# EAGLE design RHC12-BTA (EAGLE 7.2.0)
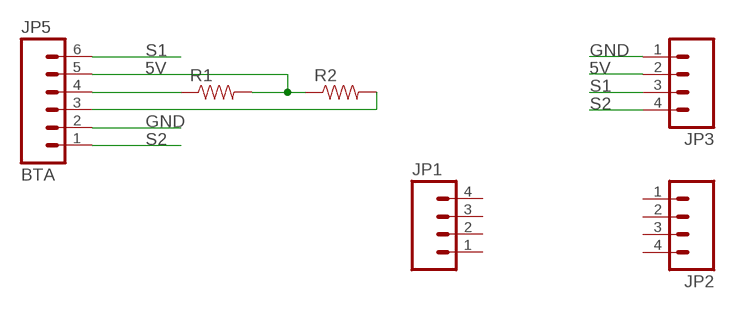
[diagram p0: schematic, sheet 1]

## Parts
JP1  M04SMD  [1X04-SMD]
JP2  M04SMD  [1X04-SMD]
JP3  M04SMD  [1X04-SMD]
JP5  BTA  M06VERNIER-ANALOG  [BTA]
R1  RESISTOR0603-RES  [0603-RES]
R2  RESISTOR0603-RES  [0603-RES]

## Nets
5V: JP3.2 JP5.5 R1.2 R2.1
GND: JP3.1 JP5.2
N$1: JP5.4 R1.1
N$3: JP5.3 R2.2
S1: JP3.3 JP5.6
S2: JP3.4 JP5.1
Unconnected: JP1.1 JP1.2 JP1.3 JP1.4 JP2.1 JP2.2 JP2.3 JP2.4

## Library data of the parts
JP1-JP3 = SparkFun-Connectors:M04: Header 4 Standard 4-pin 0.1" header. Use with straight break away headers (SKU : PRT-00116), right angle break away headers (PRT-00553), swiss pins (PRT-00743), machine pins (PRT-00117), and female headers (PRT-00115). Molex polarized connector foot print use with SKU : PRT-08231 with associated crimp pins and housings. 1MM SMD Version SKU: PRT-10208
JP5 = SparkFun-Connectors:M06: Header 6 Standard 6-pin 0.1" header. Use with straight break away headers (SKU : PRT-00116), right angle break away headers (PRT-00553), swiss pins (PRT-00743), machine pins (PRT-00117), and female headers (PRT-00115). Molex polarized connector foot print use with SKU : PRT-08094 with associated crimp pins and housings. NOTES ON THE VARIANTS LOCK and LOCK_LONGPADS... This footprint was designed to help hold the alignment of a through-hole component (i.e. 6-pin header) while soldering it into place. You may notice that each hole has been shifted either up or down by 0.005 of an inch from it's more standard position (which is a perfectly straight line). This slight alteration caused the pins (the squares in the middle) to touch the edges of the holes. Because they are alternating, it causes a "brace" to hold the component in place. 0.005 has proven to be the perfect amount of "off-center" position when using our standard breakaway headers. Although looks a little odd when you look at the bare footprint, once you have a header in there, the alteration is very hard to notice. Also,if you push a header all the way into place, it is covered up entirely on the bottom side. This idea of altering the position of holes to aid alignment will be further integrated into the Sparkfun Library for other footprints. It can help hold any component with 3 or more connection pins.
R1 R2 = SparkFun-Passives:RESISTOR: Resistor Basic schematic elements and footprints for 0603, 1206, and PTH resistors.

## Board
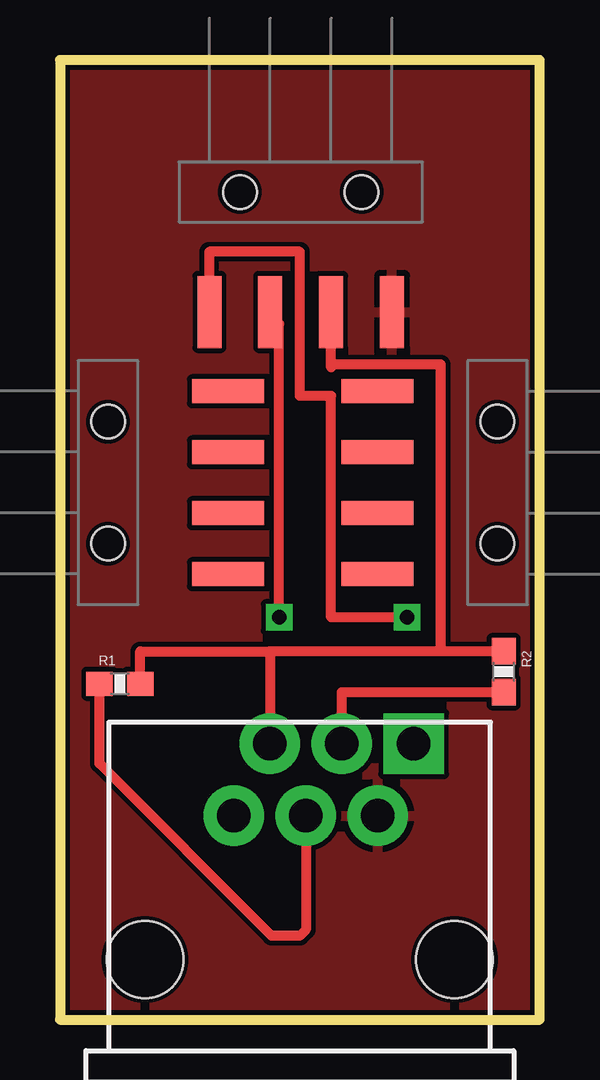
[diagram p1: board, top side]
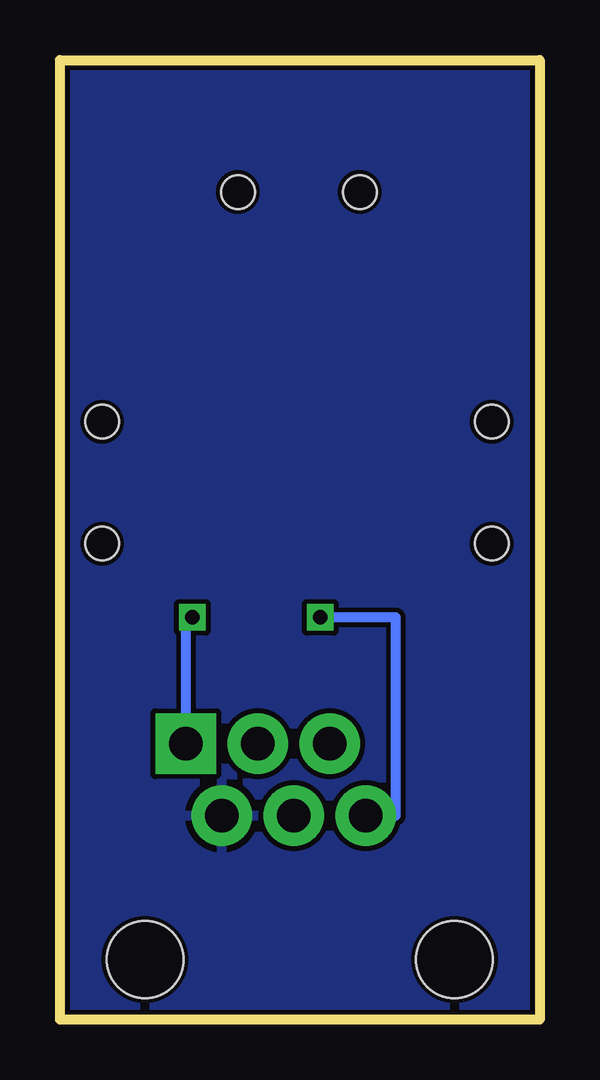
[diagram p2: board, bottom side, seen from below]

Size 20 x 40 mm. Coordinates in mm from the lower left corner, seen from the top.
Outline: 0,0 20,0 20,40 0,40 0,0
Copper layers (1*16): Top 0.035mm / dielectric 1.5mm / Bottom 0.035mm
Design rules "SparkFun-2-layer *": minimum track width 10mil, minimum drill 15mil, track to track 8mil, track to pad 8mil, pad to pad 8mil, via to via 8mil, smd to smd 8mil, copper to edge 8mil, drill to drill 8mil, minimum pad ring 12mil, minimum via ring 10mil, stop-mask expansion 4mil, vias tented up to drill 20mil, thermal gap 10mil

### Footprints (pad centres in the part's own frame; a part is rotated, then mirrored left to right if it is on the bottom)
1X04-SMD = smd 1 x 3: 1 -3.81,5; 2 -1.27,5; 3 1.27,5; 4 3.81,5 | hole 1.4: -2.54,0; 2.54,0
BTA = drill 1.4 pad 2.54 square: 1 4.75,9 | drill 1.4 pad 2.54: 2 3.25,6; 3 1.75,9; 4 0.25,6; 5 -1.25,9; 6 -2.75,6 | hole 3.2: 6.45,0; -6.45,0
0603-RES = smd 1.1 x 1: 1 -0.85,0; 2 0.85,0

### Placement (x,y rotation side)
JP1  2,22.38 270 top
JP2  18.24,22.38 90 top
JP3  10.04,34.5 180 top
JP5  10,2.5 0 top
R1  2.5,14 0 top
R2  18.5,14.5 270 top

### Tracks (layer width: path | path; a pad name or v marks a point on that pad's centre or on a via)
5V
  Top 0.406: R2.1 15.88,15.35 | 15.88,15.35 15.88,27.3 11.3,27.3 11.3,27.18 11.31,27.18 JP3.2 | 15.88,15.35 8.75,15.35 | 8.75,15.35 JP5.5 | R1.2 3.35,15.35 8.75,15.35
GND
  pour Top: 0,0 20,0 20,40 0,40
  pour Bottom: 0,0 20,0 20,40 0,40
N$1
  Top 0.406: JP5.4 10.25,3.75 10,3.5 8.82,3.5 1.65,10.67 R1.1
N$3
  Top 0.406: JP5.3 11.75,13.65 R2.2
S1  (via drill 0.6)
  Top 0.406: 9,29.5 9,29 9.14,29 v9.14,16.76 | 9,29.5 JP3.3 | 9.02,28.24 9.02,29.5 9,29.5 | 9,29.5 9,30
  Bottom 0.406: 6,16.76 v9.14,16.76 | JP5.6 6,8.5 6,16.76 | 6,16.76
S2  (via drill 0.6)
  Top 0.406: v14.48,16.76 11.3,16.76 11.3,26 10,26 10,32 6.22,32 JP3.4
  Bottom 0.406: JP5.1 14.75,16.76 v14.48,16.76